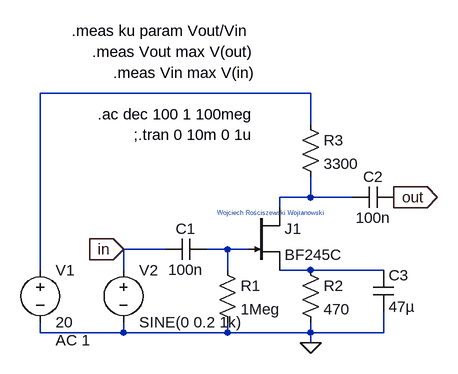
[diagram p0: schematic transistor amplifier circuit 3.asc]
transistor amplifier circuit 3.asc, the LTspice schematic file:
Version 4
SHEET 1 880 680
WIRE 352 -96 -64 -96
WIRE 352 -48 352 -96
WIRE 352 64 352 32
WIRE 352 64 304 64
WIRE 416 64 352 64
WIRE 304 80 304 64
WIRE 128 144 64 144
WIRE 224 144 192 144
WIRE 256 144 224 144
WIRE -64 176 -64 -96
WIRE 64 176 64 144
WIRE 224 176 224 144
WIRE 352 176 304 176
WIRE 464 176 352 176
WIRE -64 272 -64 256
WIRE 64 272 64 256
WIRE 64 272 -64 272
WIRE 224 272 224 256
WIRE 224 272 64 272
WIRE 352 272 352 256
WIRE 352 272 224 272
WIRE 464 272 464 240
WIRE 464 272 352 272
WIRE 352 288 352 272
FLAG 352 288 0
FLAG 480 64 out
IOPIN 480 64 Out
FLAG 64 144 in
IOPIN 64 144 In
SYMBOL voltage -64 160 R0
WINDOW 123 24 124 Left 2
WINDOW 39 0 0 Left 0
SYMATTR InstName V1
SYMATTR Value 20
SYMATTR Value2 AC 1
SYMBOL voltage 64 160 R0
WINDOW 123 0 0 Left 0
WINDOW 39 0 0 Left 0
SYMATTR InstName V2
SYMATTR Value SINE(0 0.2 1k)
SYMBOL cap 192 128 R90
WINDOW 0 0 32 VBottom 2
WINDOW 3 32 32 VTop 2
SYMATTR InstName C1
SYMATTR Value 100n
SYMBOL res 208 160 R0
SYMATTR InstName R1
SYMATTR Value 1Meg
SYMBOL res 336 160 R0
SYMATTR InstName R2
SYMATTR Value 470
SYMBOL cap 480 48 R90
WINDOW 0 0 32 VBottom 2
WINDOW 3 32 32 VTop 2
SYMATTR InstName C2
SYMATTR Value 100n
SYMBOL cap 448 176 R0
SYMATTR InstName C3
SYMATTR Value 47µ
SYMBOL res 336 -64 R0
SYMATTR InstName R3
SYMATTR Value 3300
SYMBOL njf 256 80 R0
SYMATTR InstName J1
SYMATTR Value BF245C
TEXT 208 88 Left 0 ;Wojciech Rościszewski Wojtanowski
TEXT 80 -32 Left 2 !;.tran 0 10m 0 1u
TEXT 24 -64 Left 2 !.ac dec 100 1 100meg
TEXT 48 -128 Left 2 !.meas Vin max V(in)
TEXT 16 -160 Left 2 !.meas Vout max V(out)
TEXT -16 -192 Left 2 !.meas ku param Vout/Vin

The netlist it stands for:
* transistor amplifier circuit 3.asc
V1 N001 0 20 AC 1
V2 in 0 SINE(0 0.2 1k)
C1 N003 in 100n
R1 N003 0 1Meg
R2 N004 0 470
C2 out N002 100n
C3 N004 0 47µ
R3 N001 N002 3300
J1 N002 N003 N004 BF245C
.model NJF NJF
.model PJF PJF
.lib standard.jft
* Wojciech Rościszewski Wojtanowski
;.tran 0 10m 0 1u
.ac dec 100 1 100meg
.meas Vin max V(in)
.meas Vout max V(out)
.meas ku param Vout/Vin
.backanno
.end